# EAGLE design ETAP (EAGLE 6.5.0)
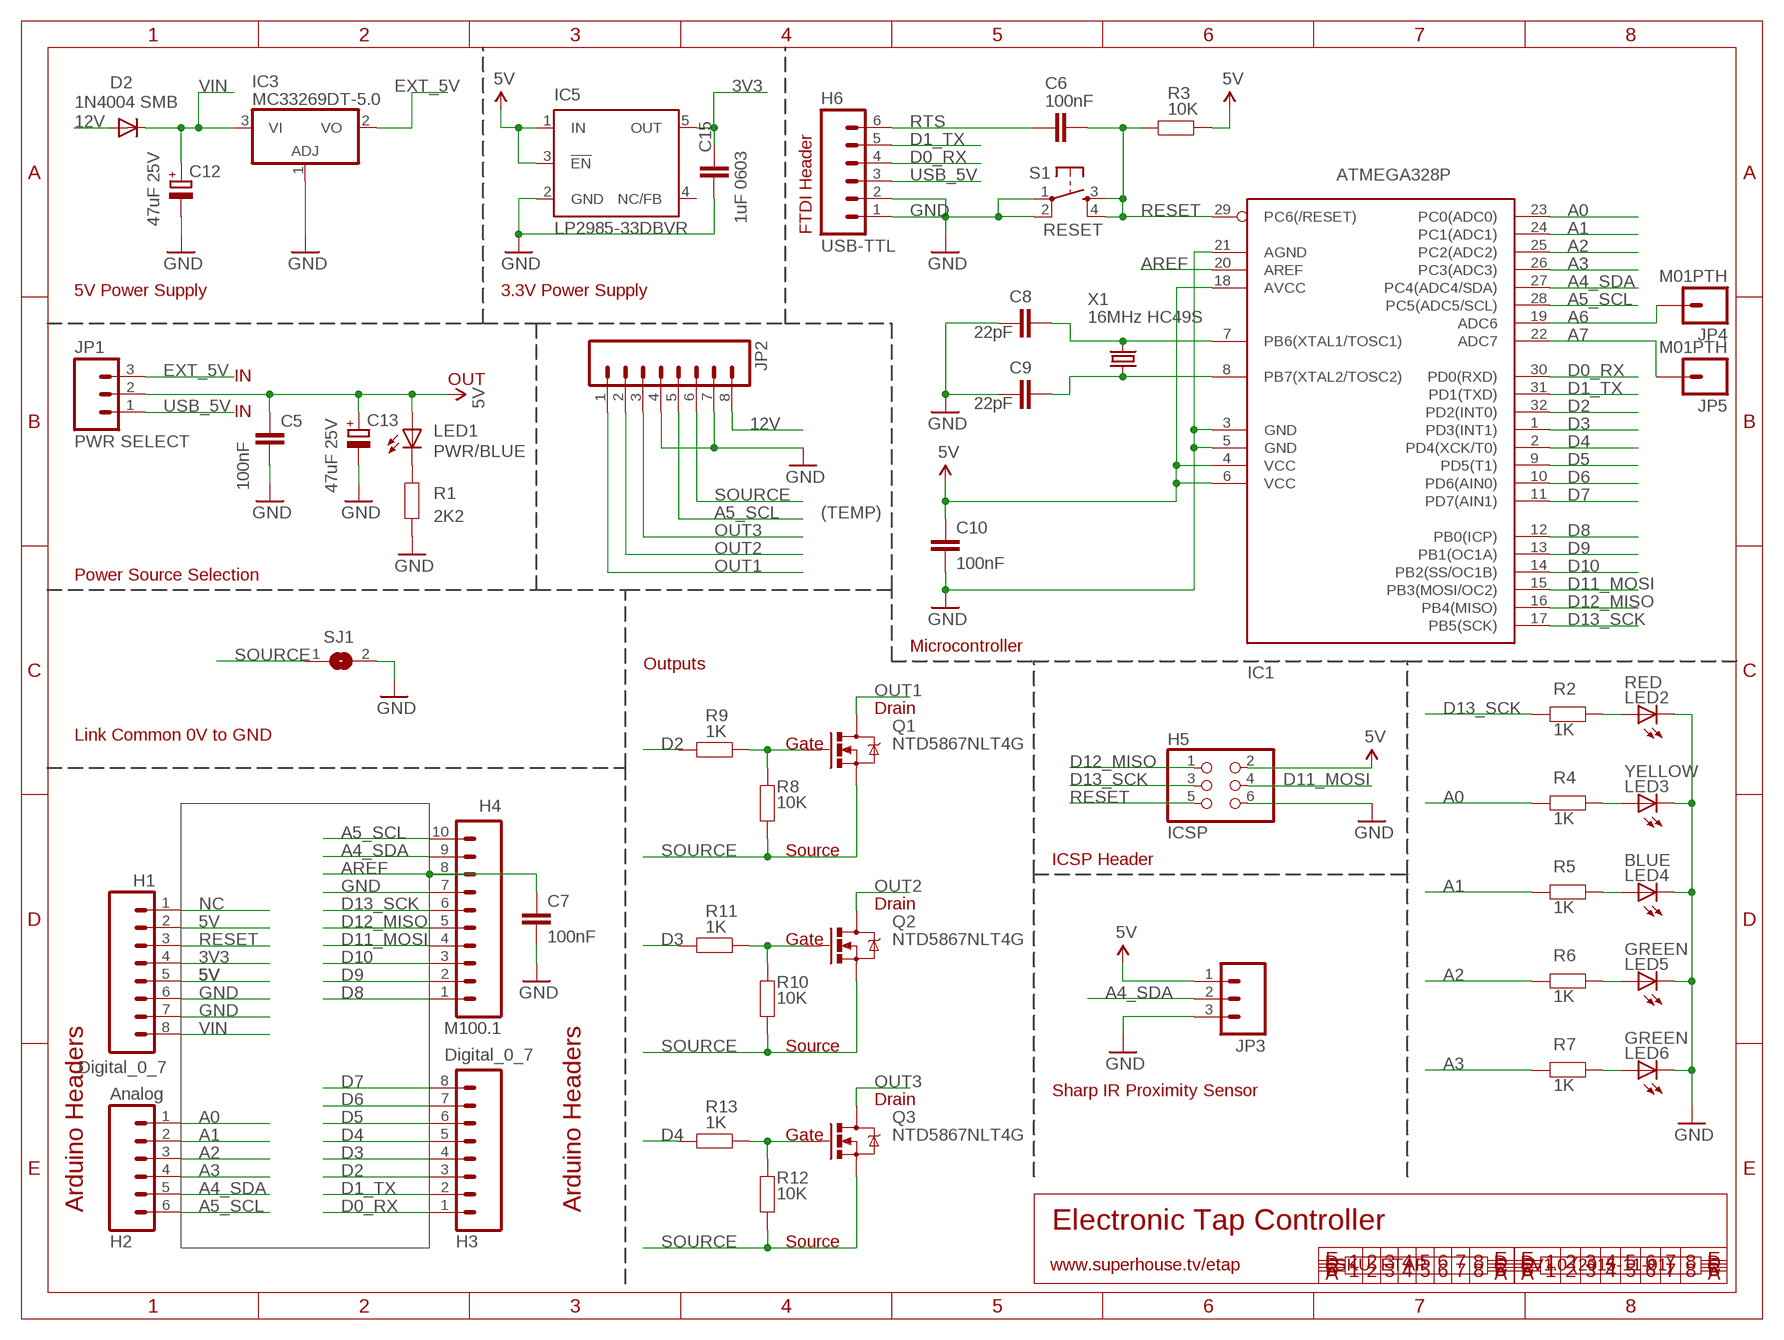
[diagram p0: schematic, sheet 1]

## Parts
C5  100nF  CAP0603  [0603]
C6  100nF  CAP0603  [0603]
C7  100nF  CAP0603  [0603]
C8  22pF  CAP0603  [0603]
C9  22pF  CAP0603  [0603]
C10  100nF  CAP0603  [0603]
C12  47uF 25V  CPOL-EUD  [PANASONIC_D]
C13  47uF 25V  CPOL-EUD  [PANASONIC_D]
C15  1uF 0603  CAP0603  [0603]
D2  1N4004 SMB  DIODESMB  [SMB-DIODE]
H1  Digital_0_7  M08  [1X08]
H2  Analog  M06SIP  [1X06]
H3  Digital_0_7  M08  [1X08]
H4  M100.1  [1X10]
H5  ICSP  PINHD-2X3  [2X03]
H6  USB-TTL  M06SIP  [1X06]
IC1  ATMEGA328P  AVR-MEGA8-AI  [TQFP32-08]
IC3  MC33269DT-5.0  MC33269D-5.0  [DPACK]
IC5  LP2985-33DBVR  TEXAS_TPS77033  [TEXAS_SOT23-DBV]
JP1  PWR SELECT  M03PTH  [1X03]
JP2  M08STD  [1X08]
JP3  M03PTH  [1X03]
JP4  M01PTH  [1X01]
JP5  M01PTH  [1X01]
LED1  PWR/BLUE  LED0603  [LED-0603]
LED2  RED  LED3MM  [LED3MM]
LED3  YELLOW  LED3MM  [LED3MM]
LED4  BLUE  LED3MM  [LED3MM]
LED5  GREEN  LED3MM  [LED3MM]
LED6  GREEN  LED3MM  [LED3MM]
Q1  NTD5867NLT4G  MOSFET-NCHANNELDPAK  [DPACK]
Q2  NTD5867NLT4G  MOSFET-NCHANNELDPAK  [DPACK]
Q3  NTD5867NLT4G  MOSFET-NCHANNELDPAK  [DPACK]
R1  2K2  RESISTOR0603  [0603]
R2  1K  RESISTOR0603  [0603]
R3  10K  RESISTOR0603  [0603]
R4  1K  RESISTOR0603  [0603]
R5  1K  RESISTOR0603  [0603]
R6  1K  RESISTOR0603  [0603]
R7  1K  RESISTOR0603  [0603]
R8  10K  RESISTOR0603  [0603]
R9  1K  RESISTOR0603  [0603]
R10  10K  RESISTOR0603  [0603]
R11  1K  RESISTOR0603  [0603]
R12  10K  RESISTOR0603  [0603]
R13  1K  RESISTOR0603  [0603]
S1  RESET  TAC_SWITCHPTH  [TACTILE-PTH]
SJ1  SJ  [SJ]
X1  16MHz HC49S  CRYSTALHC49UV  [HC49U-V]

## Nets
3V3: C15.2 H1.4 IC5.5(OUT)
5V: C5.1 C10.1 C13.+ H1.2 H1.5 H5.2 IC1.4(VCC) IC1.6(VCC) IC1.18(AVCC) IC5.1(IN) IC5.3(!EN) JP1.2 JP3.1 LED1.A R3.2
12V: D2.A JP2.8
A0: H2.1 IC1.23(PC0(ADC0)) R4.2
A1: H2.2 IC1.24(PC1(ADC1)) R5.2
A2: H2.3 IC1.25(PC2(ADC2)) R6.2
A3: H2.4 IC1.26(PC3(ADC3)) R7.2
A4_SDA: H2.5 H4.9 IC1.27(PC4(ADC4/SDA)) JP3.2
A5_SCL: H2.6 H4.10 IC1.28(PC5(ADC5/SCL)) JP2.5
A6: IC1.19(ADC6) JP4.1
A7: IC1.22(ADC7) JP5.1
AREF: C7.1 H4.8 IC1.20(AREF)
D0_RX: H3.1 H6.4 IC1.30(PD0(RXD))
D1_TX: H3.2 H6.5 IC1.31(PD1(TXD))
D2: H3.3 IC1.32(PD2(INT0)) R9.2
D3: H3.4 IC1.1(PD3(INT1)) R11.2
D4: H3.5 IC1.2(PD4(XCK/T0)) R13.2
D5: H3.6 IC1.9(PD5(T1))
D6: H3.7 IC1.10(PD6(AIN0))
D7: H3.8 IC1.11(PD7(AIN1))
D8: H4.1 IC1.12(PB0(ICP))
D9: H4.2 IC1.13(PB1(OC1A))
D10: H4.3 IC1.14(PB2(SS/OC1B))
D11_MOSI: H4.4 H5.4 IC1.15(PB3(MOSI/OC2))
D12_MISO: H4.5 H5.1 IC1.16(PB4(MISO))
D13_SCK: H4.6 H5.3 IC1.17(PB5(SCK)) R2.2
EXT_5V: IC3.2(VO) JP1.3
GND: C5.2 C7.2 C8.1 C9.1 C10.2 C12.- C13.- C15.1 H1.6 H1.7 H4.7 H5.6 H6.1 H6.2 IC1.3(GND) IC1.5(GND) IC1.21(AGND) IC3.1(ADJ) IC5.2(GND) JP2.4 JP2.7 JP3.3 LED2.K(C) LED3.K(C) LED4.K(C) LED5.K(C) LED6.K(C) R1.1 S1.1 S1.2 SJ1.2
N$1: Q2.1(G) R10.2 R11.1
N$2: LED2.A R2.1
N$3: Q1.1(G) R8.2 R9.1
N$4: Q3.1(G) R12.2 R13.1
N$5: C8.2 IC1.7(PB6(XTAL1/TOSC1)) X1.2
N$7: C9.2 IC1.8(PB7(XTAL2/TOSC2)) X1.1
N$9: LED3.A R4.1
N$10: LED4.A R5.1
N$11: LED5.A R6.1
N$12: LED6.A R7.1
N$14: LED1.C R1.2
NC: H1.1
OUT1: JP2.1 Q1.2(D)
OUT2: JP2.2 Q2.2(D)
OUT3: JP2.3 Q3.2(D)
RESET: C6.2 H1.3 H5.5 IC1.29(PC6(/RESET)) R3.1 S1.3 S1.4
RTS: C6.1 H6.6
SOURCE: JP2.6 Q1.3(S) Q2.3(S) Q3.3(S) R8.1 R10.1 R12.1 SJ1.1
USB_5V: H6.3 JP1.1
VIN: C12.+ D2.C H1.8 IC3.3(VI)
Unconnected: IC5.4(NC/FB)

## Notes on the sheet
- FTDI Header
- 5V Power Supply | 3.3V Power Supply
- IN | OUT
- IN
- (TEMP)
- Power Source Selection
- Microcontroller
- Outputs
- Drain
- Link Common 0V to GND
- Gate
- Source
- ICSP Header
- Drain
- Gate
- Source
- Sharp IR Proximity Sensor
- Drain
- Gate
- Arduino Headers | Arduino Headers
- Electronic Tap Controller
- Source
- www.superhouse.tv/etap | SKU: ETAP | V1.0 (2015-11-01)

## Library data of the parts
C5-C10 = freetronics-master-v1.1:CAP: Capacitor Standard 0603 ceramic capacitor, and 0.1" leaded capacitor.
C12 C13 = rcl:CPOL-EU: POLARIZED CAPACITOR, European symbol
C15 = freetronics:CAP: Capacitor Standard 0603 ceramic capacitor, and 0.1" leaded capacitor.
D2 = freetronics:DIODE: Diode These are standard reverse protection diodes and small signal diodes. SMA package can handle up to about 1A. SOD-323 can handle about 200mA. What the SOD-323 package when ordering, there are some mfgs out there that are 5-pin packages.
H1 H3 = freetronics:M08: Header 8 Standard 8-pin 0.1" header. Use with straight break away headers (SKU : PRT-00116), right angle break away headers (PRT-00553), swiss pins (PRT-00743), machine pins (PRT-00117), and female headers (PRT-00115).
H2 H6 = freetronics:M06: Header 6 Standard 6-pin 0.1" header. Use with straight break away headers (SKU : PRT-00116), right angle break away headers (PRT-00553), swiss pins (PRT-00743), machine pins (PRT-00117), and female headers (PRT-00115). Molex polarized connector foot print use with SKU : PRT-08094 with associated crimp pins and housings. NOTES ON THE VARIANTS LOCK and LOCK_LONGPADS... This footprint was designed to help hold the alignment of a through-hole component (i.e. 6-pin header) while soldering it into place. You may notice that each hole has been shifted either up or down by 0.005 of an inch from it's more standard position (which is a perfectly straight line). This slight alteration caused the pins (the squares in the middle) to touch the edges of the holes. Because they are alternating, it causes a "brace" to hold the component in place. 0.005 has proven to be the perfect amount of "off-center" position when using our standard breakaway headers. Although looks a little odd when you look at the bare footprint, once you have a header in there, the alteration is very hard to notice. Also, if you push a header all the way into place, it is covered up entirely on the bottom side. This idea of altering the position of holes to aid alignment will be further integrated into the Sparkfun Library for other footprints. It can help hold any component with 3 or more connection pins.
H4 = freetronics-marc:M10: Header 10 Standard 10-pin 0.1" header. Use with straight break away headers (SKU : PRT-00116), right angle break away headers (PRT-00553), swiss pins (PRT-00743), machine pins (PRT-00117), and female headers (PRT-00115).
H5 = pinhead:PINHD-2X3: PIN HEADER
IC1 = freetronics-master-v1.1:AVR-MEGA8: MICROCONTROLLER 8 Kbytes FLASH 1 kbytes SRAM 512 bytes EEPROM USART 6-channel 10 bit ADC 2-channel 8 bit ADC
IC3 = linear:MC33269?*: Adjustable Output Low Dropout Voltage Regulator 800 mA Source: http://www.onsemi.com/pub/Collateral/MC33269-D.PDF
IC5 = freetronics-jon:TEXAS_TPS770*: ULTRALOW-POWER 50-mA LOW-DROPOUT LINEAR REGULATORS 50-mA Low-Dropout Regulator Source: http://focus.ti.com/lit/ds/symlink/tps77001.pdf
JP1 = freetronics-2:M03: Header 3 Standard 3-pin 0.1" header. Use with straight break away headers (SKU : PRT-00116), right angle break away headers (PRT-00553), swiss pins (PRT-00743), machine pins (PRT-00117), and female headers (PRT-00115). Molex polarized connector foot print use with SKU : PRT-08232 with associated crimp pins and housings.
JP2 = freetronics-master-v1.1:M08: Header 8 Standard 8-pin 0.1" header. Use with straight break away headers (SKU : PRT-00116), right angle break away headers (PRT-00553), swiss pins (PRT-00743), machine pins (PRT-00117), and female headers (PRT-00115).
JP3 = freetronics-jon:M03: Header 3 Standard 3-pin 0.1" header. Use with straight break away headers (SKU : PRT-00116), right angle break away headers (PRT-00553), swiss pins (PRT-00743), machine pins (PRT-00117), and female headers (PRT-00115). Molex polarized connector foot print use with SKU : PRT-08232 with associated crimp pins and housings.
JP4 JP5 = freetronics-master-v1.1:M01: Header 1 Standard 1-pin 0.1" header. Use with straight break away headers (SKU : PRT-00116), right angle break away headers (PRT-00553), swiss pins (PRT-00743), machine pins (PRT-00117), and female headers (PRT-00115).
LED1 = freetronics-jon:LED: LEDs Standard schematic elements and footprints for 5mm, 3mm, 1206, and 0603 sized LEDs. 5mm - Spark Fun Electronics SKU : COM-00529 (and others)
LED2-LED6 = freetronics-2:LED: LEDs Standard schematic elements and footprints for 5mm, 3mm, 1206, and 0603 sized LEDs. 5mm - Spark Fun Electronics SKU : COM-00529 (and others)
Q1-Q3 = freetronics-master-v1.1:MOSFET-NCHANNEL
R1-R7 = freetronics-master-v1.1:RESISTOR: Resistor Basic schematic elements and footprints for 0603, 1206, and PTH 1/10th watt (small) resistors.
R8-R13 = freetronics-master-v1:RESISTOR: Resistor Basic schematic elements and footprints for 0603, 1206, and PTH 1/10th watt (small) resistors.
S1 = freetronics-2:TAC_SWITCH: Momentary Switch Button commonly used for reset or general input. Spark Fun Electronics SKU : COM-00097
SJ1 = freetronics-master-v1.1:SJ: SMD solder JUMPER
X1 = freetronics:CRYSTAL: Crystals Various standard crystals. Proven footprints. Spark Fun Electronics SKU : COM-00534

## Board
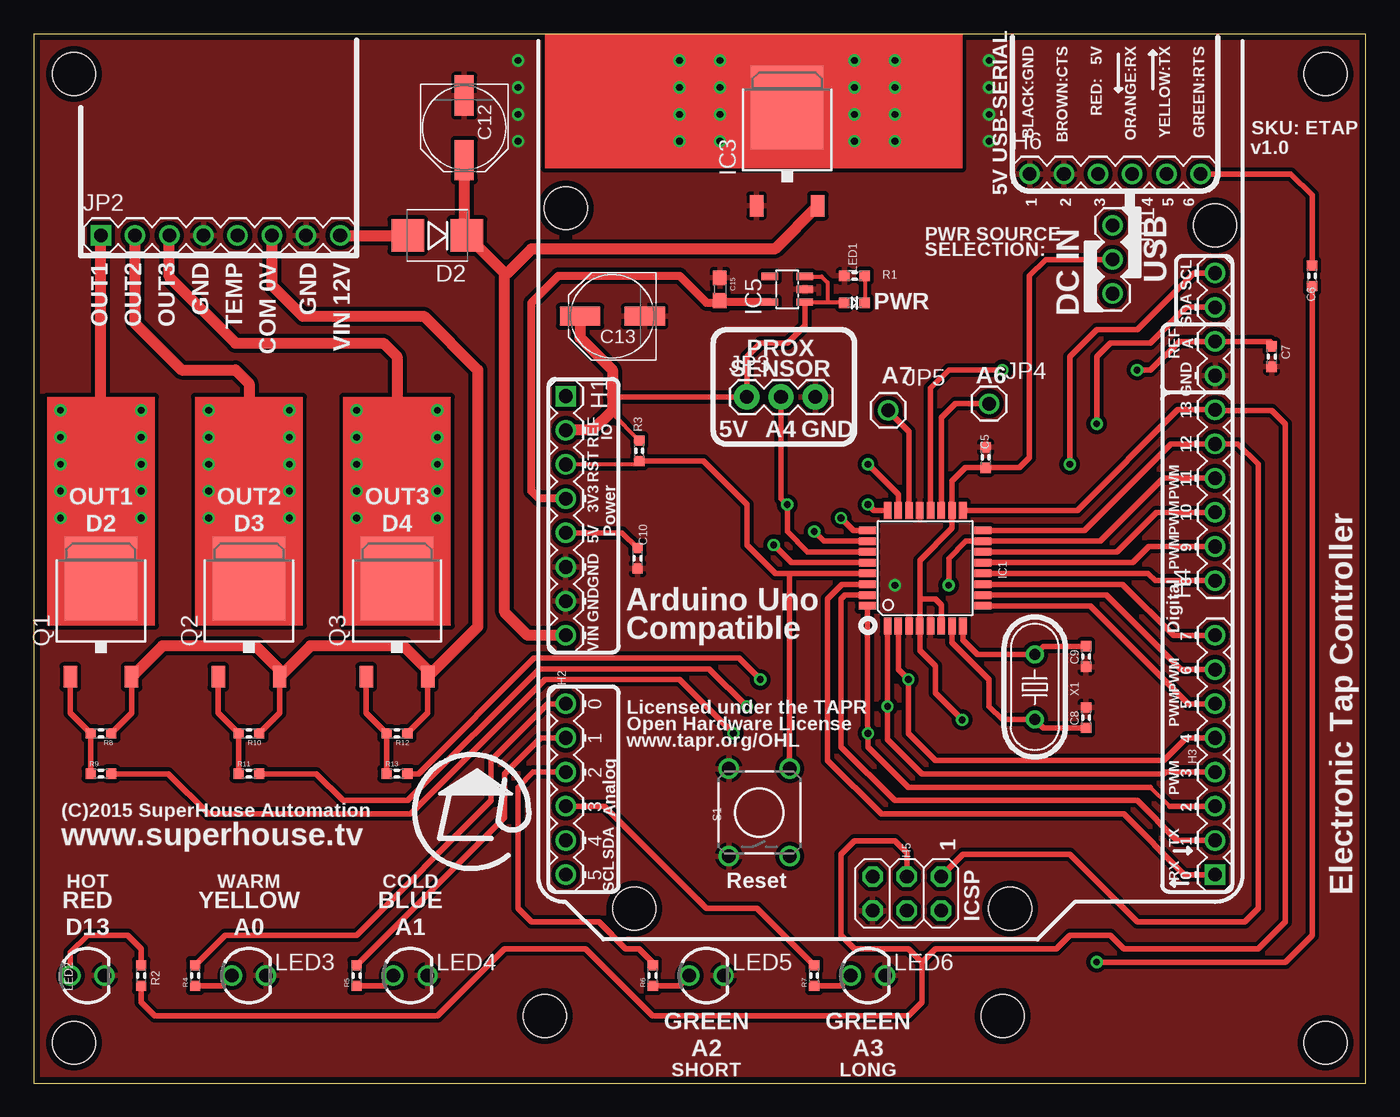
[diagram p1: board, top side]
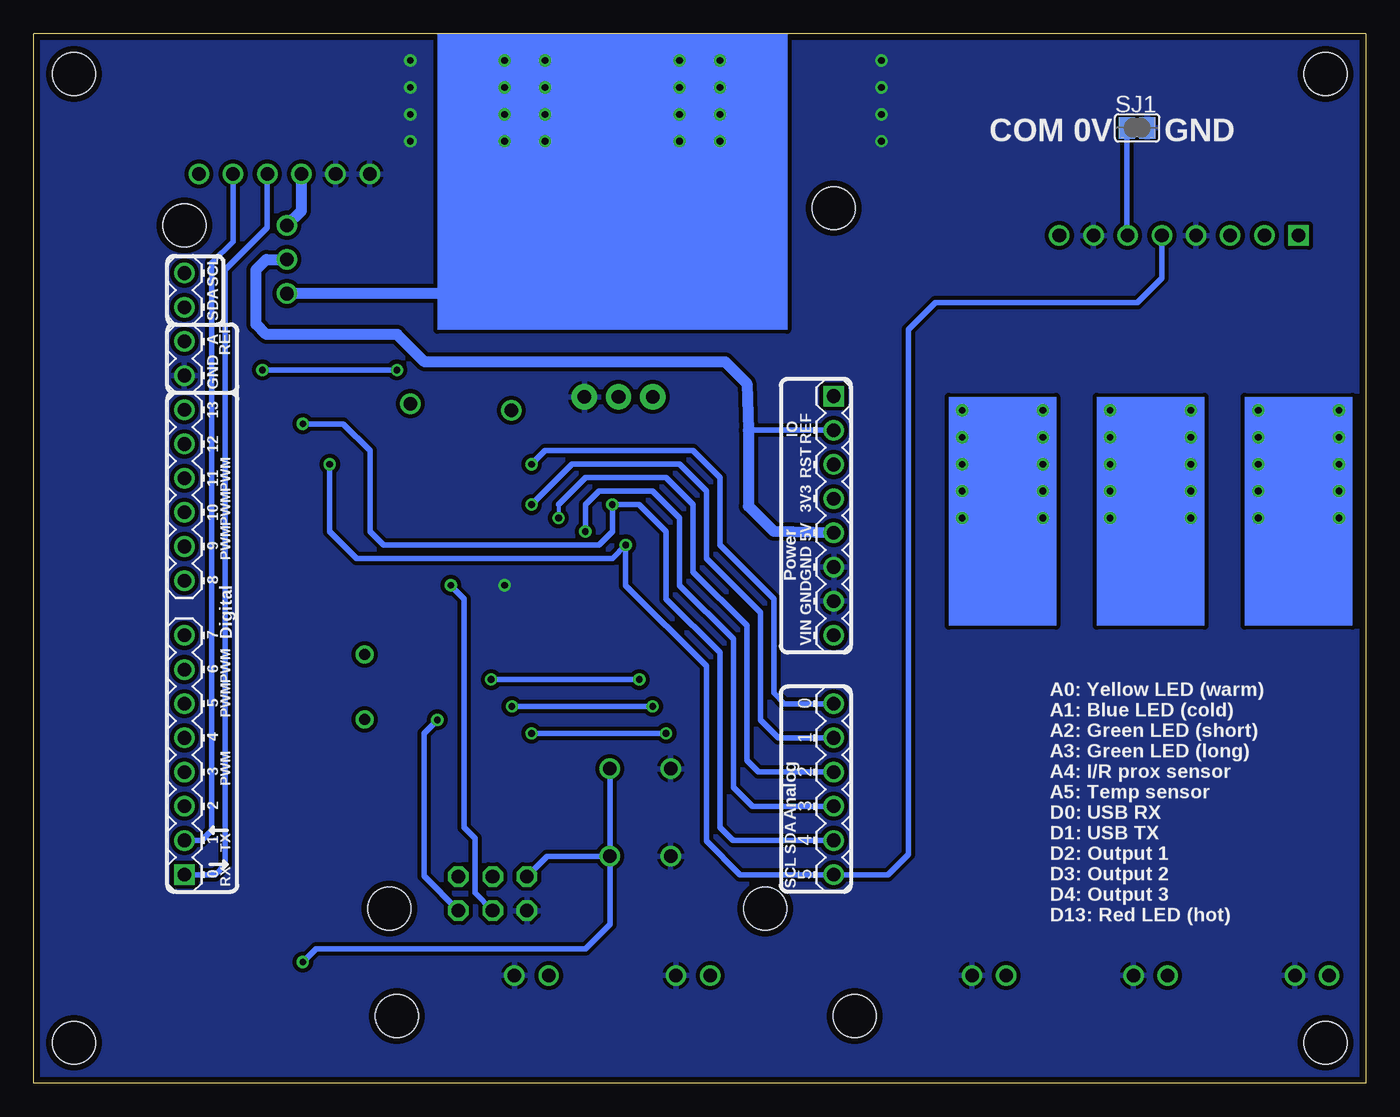
[diagram p2: board, bottom side, seen from below]

Size 99 x 78 mm. Coordinates in mm from the lower left corner, seen from the top.
Outline: 0,0 99,0 99,78 0,78 0,0
Copper layers (1*16): Top 0.035mm / dielectric 1.5mm / Bottom 0.035mm
Design rules "default *": minimum track width 10mil, minimum drill 18mil, track to track 10mil, track to pad 10mil, pad to pad 10mil, via to via 10mil, smd to smd 8mil, copper to edge 18mil, drill to drill 8mil, minimum pad ring 10mil, minimum via ring 8mil, stop-mask expansion 4mil, vias tented up to drill 25mil, thermal gap 10mil
Holes 3.2 mm at 72.56,12.96 44.62,12.96 87.8,63.76 39.54,65.03 38,5 72,5 96,3 96,75 3,75 3,3

### Footprints (pad centres in the part's own frame; a part is rotated, then mirrored left to right if it is on the bottom)
0603 = smd 0.762 x 0.762: 1 -0.762,0; 2 0.762,0
PANASONIC_D = smd 3 x 1.4: + 2.4,0; - -2.4,0
0603' = smd 1.1 x 1: 1 -0.85,0; 2 0.85,0
SMB-DIODE = smd 2.4 x 2.4: A 2.2,0; C -2.2,0
1X08 = drill 1.016 square: 1 0,0 | drill 1.016: 2 2.54,0; 3 5.08,0; 4 7.62,0; 5 10.16,0; 6 12.7,0; 7 15.24,0; 8 17.78,0
1X06 = drill 1.016: 1 0,0; 2 2.54,0; 3 5.08,0; 4 7.62,0; 5 10.16,0; 6 12.7,0
1X10 = drill 1.016: 1 0,0; 2 2.54,0; 3 5.08,0; 4 7.62,0; 5 10.16,0; 6 12.7,0; 7 15.24,0; 8 17.78,0; 9 20.32,0; 10 22.86,0
2X03 = drill 1.016 octagon: 1 -2.54,-1.27; 2 -2.54,1.27; 3 0,-1.27; 4 0,1.27; 5 2.54,-1.27; 6 2.54,1.27
TQFP32-08 = smd 1.27 x 0.559: 1 -4.293,2.8; 2 -4.293,2; 3 -4.293,1.2; 4 -4.293,0.4; 5 -4.293,-0.4; 6 -4.293,-1.2; 7 -4.293,-2; 8 -4.293,-2.8; 17 4.293,-2.8; 18 4.293,-2; 19 4.293,-1.2; 20 4.293,-0.4; 21 4.293,0.4; 22 4.293,1.2; 23 4.293,2; 24 4.293,2.8 | smd 0.559 x 1.27: 9 -2.8,-4.293; 10 -2,-4.293; 11 -1.2,-4.293; 12 -0.4,-4.293; 13 0.4,-4.293; 14 1.2,-4.293; 15 2,-4.293; 16 2.8,-4.293; 25 2.8,4.293; 26 2,4.293; 27 1.2,4.293; 28 0.4,4.293; 29 -0.4,4.293; 30 -1.2,4.293; 31 -2,4.293; 32 -2.8,4.293
DPACK = smd 1 x 1.6: 1 -2.28,-4.8; 3 2.28,-4.8 | smd 5.4 x 6.2: 2 0,2.5
TEXAS_SOT23-DBV = smd 0.55 x 1.2: 1 -0.95,-1.3; 2 0,-1.3; 3 0.95,-1.3; 4 0.95,1.3; 5 -0.95,1.3
1X03 = drill 1.016: 1 0,0; 2 2.54,0; 3 5.08,0
1X03' = drill 1.016 pad 1.88: 1 0,0; 2 2.54,0; 3 5.08,0
1X01 = drill 1.016: 1 0,0
LED-0603 = smd 0.762 x 0.762: A -0.762,0; C 0.762,0
LED3MM = drill 1: A -1.27,0; K 1.27,0
TACTILE-PTH = drill 1.016: 1 -3.251,2.261; 2 3.251,2.261; 3 -3.251,-2.261; 4 3.251,-2.261
SJ = smd 1.168 x 1.6: 1 -0.762,0; 2 0.762,0
HC49U-V = drill 0.813: 1 -2.413,0; 2 2.413,0

### Placement (x,y rotation side)
C5  70.75,46.5 90 top
C6  95,60 270 top
C7  92,54 270 top
C8  78.21,27.17 270 top
C9  78.21,31.71 90 top
C10  44.87,39.01 270 top
C12  32,71 270 top
C13  43,57 180 top
C15  1uF 0603  [0603']  51,59 270 top
D2  30,63 180 top
H1  39.54,51.06 270 top
H2  39.54,28.2 270 top
H3  87.8,15.5 90 top
H4  87.8,37.34 90 top
H5  64.89,14.09 180 top
H6  74.02,67.57 0 top
IC1  66.26,38.28 90 top
IC3  56,70 0 top
IC5  56,59 90 top
JP1  80.18,63.76 270 top
JP2  5,63 0 top
JP3  [1X03']  53,51 0 top
JP4  71,50.5 0 top
JP5  63.5,50 0 top
LED1  61,58 0 top
LED2  4,8 0 top
LED3  16,8 0 top
LED4  28,8 0 top
LED5  50,8 0 top
LED6  62,8 0 top
Q1  5,35 0 top
Q2  16,35 0 top
Q3  27,35 0 top
R1  61,60 0 top
R2  8,8 270 top
R3  45,47 90 top
R4  12,8 90 top
R5  24,8 90 top
R6  46,8 90 top
R7  58,8 90 top
R8  5,26 180 top
R9  5,23 0 top
R10  16,26 180 top
R11  16,23 0 top
R12  27,26 180 top
R13  27,23 0 top
S1  53.92,20.12 90 top
SJ1  17,71 0 bottom
X1  74.4,29.44 270 top

### Tracks (layer width: path | path; a pad name or v marks a point on that pad's centre or on a via)
3V3
  Top 0.305: 51.1,58.05 C15.2
  Top 0.61: IC5.5 51.1,58.05 | H1.4 37.56,43.44 37,44 37,58 39,60 48,60 50,58 50.85,58 C15.2
5V  (via drill 0.5)
  Top 0.305: IC5.1 59,58.05 | 59,58.05 59.81,58.05 LED1.A | IC5.3 58.55,59.95 59,59.5 59,58.05 | R3.2 43,49.76 43,50
  Top 0.406: 65.86,36 IC1.4 65.86,32.14 67,31 67,29 v69,27 | 65.86,36 65.86,38.86 68.26,41.26 IC1.18 | C10.1 43.74,40.9 H1.5 | 43,51 JP3.1 53,54 54,55 56,55 57.3,56.3 IC5.1 | IC1.18 | JP1.2 75.22,61.22 74,60 74,46.5 73.24,45.74 C5.1 69.24,45.74 68.26,44.76 IC1.18 | IC1.6 67.46,35.54 67,36 65.86,36
  Top 0.813: C13.+ 40.6,55.4 43,53 43,51 43,50 41.52,48.52 H1.2
  Bottom 0.406: H1.2 45.89,48.52 | v69,27 70,26 70,15.39 H5.2
  Bottom 0.813: JP1.2 81.7,61.22 82.47,60.46 82.47,56.41 81.7,55.65 71.99,55.65 69.94,53.6 47.6,53.6 46,52 45.89,48.52 45.89,42.89 44,41 H1.5
12V
  Top 0.813: JP2.8 D2.A
A0  (via drill 0.5)
  Top 0.406: R4.2 14.24,11 24,11 34,21 34,24 38.2,28.2 H2.1 | v62,46 64.26,43.74 IC1.23
  Bottom 0.406: H2.1 43.2,28.2 44,29 44,36 48,40 48,45 50,47 61,47 v62,46
A1  (via drill 0.5)
  Top 0.406: R5.2 35,19.76 35,23 37.66,25.66 H2.2 | v62,43 62.43,42.57 IC1.24
  Bottom 0.406: H2.2 43.66,25.66 45,27 45,35 49,39 49,44 51,46 59,46 v62,43
A2  (via drill 0.5)
  Top 0.406: H2.3 37.12,23.12 36,22 36,13 37,12 42,12 44,10 45,10 46,9 R6.2 | v60,42 60.92,41.08 IC1.25
  Bottom 0.305: 60,43 v60,42
  Bottom 0.406: H2.3 45.12,23.12 46,24 46,34 50,38 50,43 52,45 58,45 60,43
A3  (via drill 0.5)
  Top 0.406: R7.2 53.76,13 50,13 42.42,20.58 H2.4 | v58,41 58.72,40.28 IC1.26
  Bottom 0.406: H2.4 45.58,20.58 47,22 47,33 51,37 51,42 53,44 57,44 58,43 v58,41
A4_SDA  (via drill 0.5)
  Top 0.406: IC1.27 57.52,39.48 56,41 v56,43 55.54,43.46 JP3.2 | H4.9 85.66,57.66 83,55 80,55 79,54 v79,49
  Bottom 0.406: H2.5 47.04,18.04 48,19 48,32 52,36 52,41 54,43 v56,43 56,41 57,40 73,40 74,41 74,47 76,49 v79,49
A5_SCL  (via drill 0.5)
  Top 0.406: IC1.28 56.32,38.68 v55,40 | H4.10 86.2,60.2 82,56 79,56 77,54 v77,46
  Bottom 0.406: v77,46 77,41 75,39 56,39 v55,40 55,37 49,31 49,18 46.5,15.5 H2.6 35.5,15.5 34,17 34,56 32,58 17,58 15.16,59.84 JP2.5
A6
  Top 0.406: IC1.19 67.46,49.46 68.5,50.5 JP4.1
A7
  Top 0.406: IC1.22 65.06,48.44 JP5.1
AREF  (via drill 0.5)
  Top 0.406: C7.1 91.89,55.12 H4.8 85.12,55.12 83,53 v82,53 | v72,53 68,53 66.66,51.66 IC1.20
  Bottom 0.406: v82,53 v72,53
D0_RX
  Top 0.406: IC1.30 60.08,37.08 59,36 59,24 63,20 81,20 85.5,15.5 H3.1
  Bottom 0.406: H3.1 85.51,15.5 84.75,16.26 84.75,60.46 81.64,63.57 H6.4
D1_TX
  Top 0.406: H3.2 84.96,18.04 82,21 64,21 60,25 60,36 60.28,36.28 IC1.31
  Bottom 0.406: H3.2 86.53,18.04 85.77,18.8 85.77,60.97 84.18,62.55 H6.5
D2  (via drill 0.5)
  Top 0.305: 84.42,20.58 83,22 | v62,26 62,35.44 IC1.32
  Top 0.406: H3.3 84.42,20.58 | 83,22 65,22 62,25 v62,26 61.96,27.04 IC1.32 | v52,26 48,30 38,30 28,20 13,20 10,23 R9.2
  Bottom 0.406: v52,26 v62,26
D3  (via drill 0.5)
  Top 0.406: H3.4 84.12,23.12 84,23 66,23 63.46,25.54 v63.46,28 IC1.1 | v53,28 50.2,30.8 37.6,30.8 27.8,21 23,21 21,23 R11.2
  Bottom 0.406: v53,28 v63.46,28
D4  (via drill 0.5)
  Top 0.406: H3.5 85.66,25.66 84,24 67,24 65,26 v65,30 64.26,30.74 IC1.2 | v54,30 52.4,31.6 37.2,31.6 28.6,23 R13.2
  Bottom 0.406: v54,30 v65,30
D5
  Top 0.406: H3.6 85.8,28.2 78.52,35.48 IC1.9
D6
  Top 0.406: H3.7 85.26,30.74 79.72,36.28 IC1.10
D7
  Top 0.406: H3.8 84.72,33.28 80.92,37.08 IC1.11
D8
  Top 0.406: H4.1 83.34,37.34 82.81,37.88 IC1.12
D9
  Top 0.406: H4.2 82.88,39.88 81.68,38.68 IC1.13
D10
  Top 0.406: H4.3 83.42,42.42 80.48,39.48 IC1.14
D11_MOSI  (via drill 0.5)
  Top 0.406: H4.4 83.96,44.96 79.28,40.28 IC1.15 69.28,40.28 68,39 v68,37
  Bottom 0.406: H5.4 66.2,14.13 66.2,18.2 67,19 67,36 v68,37
D12_MISO
  Top 0.406: IC1.16 78.08,41.08 84.5,47.5 H4.5 89.5,47.5 91,46 91,13 90,12 82,12 77,17 69.07,17 H5.1
D13_SCK
  Top 0.406: IC1.17 77.57,42.57 85.04,50.04 H4.6 87.84,50 92,50 93,49 93,12 91,10 81,10 80,11 77,11 76,10 67,10 66,9 | 66,9 66,6 65,5 46,5 41,10 35,10 30,5 9,5 8,6 R2.2 | 66,9 65,10 61,10 60,11 60,17 61,18 64,18 64.89,17.11 H5.3
EXT_5V  (via drill 0.5)
  Top 0.305: v48,76 v48,74 v48,72 v48,70 v51,70 v51,72 | v51,72 v51,74 v51,76 | v61,72 v61,74 v61,76 v64,76 v64,74 | v61,72 v61,70 v64,70 v64,72 | v61,72 60.5,72.5 IC3.2 55.5,72 v51,72
  Bottom 0.305: 64.23,59.95 64,60.18 v64,70
  Bottom 0.813: 64.23,59.95 65.5,58.68 JP1.3
GND  (via drill 0.5)
  other vias: 71,70 71,72 36,74 71,76 36,70 71,74 36,72 36,76 64,37
  pour Bottom (isolate 0.305): 0,78 99,78 99,0 0,0
  pour Top (isolate 0.305): 0,78 99,78 99,0 0,0
N$1
  Top 0.406: R11.1 R10.2 13.72,27.52 Q2.1
N$2
  Top 0.406: R2.1 8,10 7,11 4,11 2.73,9.73 LED2.A
N$3
  Top 0.406: R9.1 R8.2 2.72,27.52 Q1.1
N$4
  Top 0.406: R13.1 R12.2 24.72,27.52 Q3.1
N$5
  Top 0.406: C8.2 75.02,26.41 X1.2 71.97,27.03 71,28 71,30 68.26,32.74 IC1.7
N$6  (via drill 0.5)
  other vias: 2,50
N$7
  Top 0.406: C9.2 75.02,32.47 X1.1 70.15,31.85 69.06,32.94 IC1.8
N$8  (via drill 0.5)
  other vias: 2,48
N$9
  Top 0.406: LED3.A 13.97,7.24 R4.1
N$10
  Top 0.406: LED4.A 25.97,7.24 R5.1
N$11
  Top 0.406: LED5.A 47.97,7.24 R6.1
N$12
  Top 0.406: LED6.A 59.97,7.24 R7.1
N$13  (via drill 0.5)
  other vias: 2,46
N$14
  Top 0.305: R1.2 LED1.C
N$15  (via drill 0.5)
  other vias: 2,44
N$16  (via drill 0.5)
  other vias: 2,42
N$17  (via drill 0.5)
  other vias: 8,42
N$18  (via drill 0.5)
  other vias: 8,44
N$19  (via drill 0.5)
  other vias: 8,46
N$20  (via drill 0.5)
  other vias: 8,48
N$21  (via drill 0.5)
  other vias: 8,50
N$22  (via drill 0.5)
  other vias: 13,50
N$23  (via drill 0.5)
  other vias: 13,48
N$24  (via drill 0.5)
  other vias: 13,46
N$25  (via drill 0.5)
  other vias: 13,44
N$26  (via drill 0.5)
  other vias: 13,42
N$27  (via drill 0.5)
  other vias: 19,42
N$28  (via drill 0.5)
  other vias: 19,44
N$29  (via drill 0.5)
  other vias: 19,46
N$30  (via drill 0.5)
  other vias: 19,48
N$31  (via drill 0.5)
  other vias: 19,50
N$32  (via drill 0.5)
  other vias: 24,50
N$33  (via drill 0.5)
  other vias: 24,48
N$34  (via drill 0.5)
  other vias: 24,46
N$35  (via drill 0.5)
  other vias: 24,44
N$36  (via drill 0.5)
  other vias: 24,42
N$37  (via drill 0.5)
  other vias: 30,42
N$38  (via drill 0.5)
  other vias: 30,44
N$39  (via drill 0.5)
  other vias: 30,46
N$40  (via drill 0.5)
  other vias: 30,48
N$41  (via drill 0.5)
  other vias: 30,50
OUT1
  Top 0.813: Q1.2 JP2.1
OUT2
  Top 0.813: JP2.2 7.54,56.46 11,53 15,53 16,52 Q2.2
OUT3
  Top 0.813: 27,38 Q3.2 27,54 26,55 15,55 10.08,59.92 JP2.3
RESET  (via drill 0.5)
  Top 0.305: 56.19,37.7 56,37.88 | R3.1 44.74,45.98 H1.3
  Top 0.406: IC1.29 56,37.88 55.12,37.88 53,40 53,43 49.76,46.24 R3.1 | C6.2 95,11 93,9 v79,9 | S1.4 56.19,37.7
  Bottom 0.406: S1.3 S1.4 | H5.5 60.84,16.87 S1.3 | v79,9 78,10 58,10 56.19,11.81 S1.3
RTS
  Top 0.406: C6.1 95,66 93.43,67.57 H6.6
SOURCE
  Top 0.406: Q3.3 29.28,27.52 R12.1 | Q1.3 7.28,27.52 R8.1 | Q2.3 18.28,27.52 R10.1
  Top 0.813: JP2.6 17.7,59.3 20,57 29,57 33,53 33,33.92 Q3.3 29.28,30.72 27.5,32.5 20.58,32.5 Q2.3 18.28,30.72 16.5,32.5 9.58,32.5 Q1.3
  Bottom 0.406: JP2.6 17.76,63.06 SJ1.1
USB_5V
  Bottom 0.813: JP1.1 79.1,64.84 H6.3
VIN
  Top 0.813: H1.8 36.72,33.28 35,35 35,60.2 | 35,60.2 D2.C 32,63.2 C12.+ 32,69 | IC3.3 55.08,62 37,62 35.2,60.2 35,60.2
(copper drawn outside any net)
  shapes: Bottom area x4, Top area x4

### Text on the board
tPlace: 5V USB-SERIAL | BLACK:GND | BROWN:CTS | RED: 5V | ORANGE:RX | YELLOW:TX | GREEN:RTS | SKU: ETAP | v1.0 | 1 | 2 | 3 | 4 | 5 | 6 | DC IN | USB | PWR SOURCE | OUT1 | OUT2 | OUT3 | GND | TEMP | COM 0V | GND | VIN 12V | SELECTION: | SCL | SDA | PWR | REF | A | GND | PROX / SENSOR | A7 | A6 | 13 | REF | IO | 5V | A4 | GND | 12 | RST | PWM | 11 | 3V3 | Power | OUT1 | OUT2 | OUT3 | PWM | 10 | 5V | D2 | D3 | D4 | PWM | 9 | GND | 8 | GND | Digital | VIN | 7 | Arduino Uno / Compatible | PWM | 6 | 0 | PWM | 5 | Licensed under the TAPR | 1 | Open Hardware License | 4 | www.tapr.org/OHL | 2 | Analog | PWM | 3 | 3 | 2 | (C)2015 SuperHouse Automation | SDA | TX | www.superhouse.tv | 4 | 1 | 1 | SCL | RX | 5 | ICSP | 0 | HOT | WARM | COLD | Reset | Electronic Tap Controller | RED | YELLOW | BLUE | D13 | A0 | A1 | GREEN | GREEN | A2 | A3 | SHORT | LONG
bPlace: GND | COM 0V | SCL | SDA | A | REF | GND | 13 | REF | IO | 12 | RST | PWM | 11 | 3V3 | 10 | PWM | 5V | 9 | PWM | GND | Power | 8 | GND | VIN | Digital | 7 | PWM | 6 | 0 | 5 | PWM | 1 | 4 | 2 | 3 | PWM | 3 | Analog | 2 | 4 | 1 | SDA | TX | 5 | RX | 0 | SCL | A0: Yellow LED (warm) / A1: Blue LED (cold) / A2: Green LED (short) / A3: Green LED (long) / A4: I/R prox sensor / A5: Temp sensor / D0: USB RX / D1: USB TX / D2: Output 1 / D3: Output 2 / D4: Output 3 / D13: Red LED (hot)